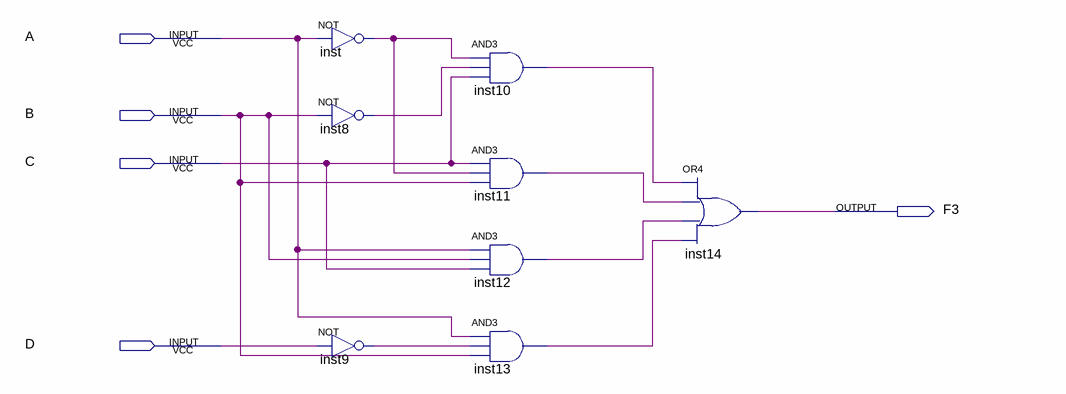
[diagram p0: schematic sheet]
// Quartus schematic LAB02_Cau4.bdf as structural Verilog: 8 symbols, 5 pins
module LAB02_Cau4 (
  input  A,
  input  B,
  input  C,
  input  D,
  output F3
);

  wire inst8_out, inst9_out, inst10_out, inst11_out, inst12_out, inst13_out, inst_out;

  not inst (inst_out, A);
  not inst8 (inst8_out, B);
  not inst9 (inst9_out, D);
  and inst10 (inst10_out, inst_out, inst8_out, C);
  and inst11 (inst11_out, C, inst_out, B);
  and inst12 (inst12_out, A, B, C);
  and inst13 (inst13_out, A, inst9_out, B);
  or inst14 (F3, inst10_out, inst11_out, inst12_out, inst13_out);
endmodule
